# Altium project EVK-NORA-W1.PrjPcb (part 3 of 3)
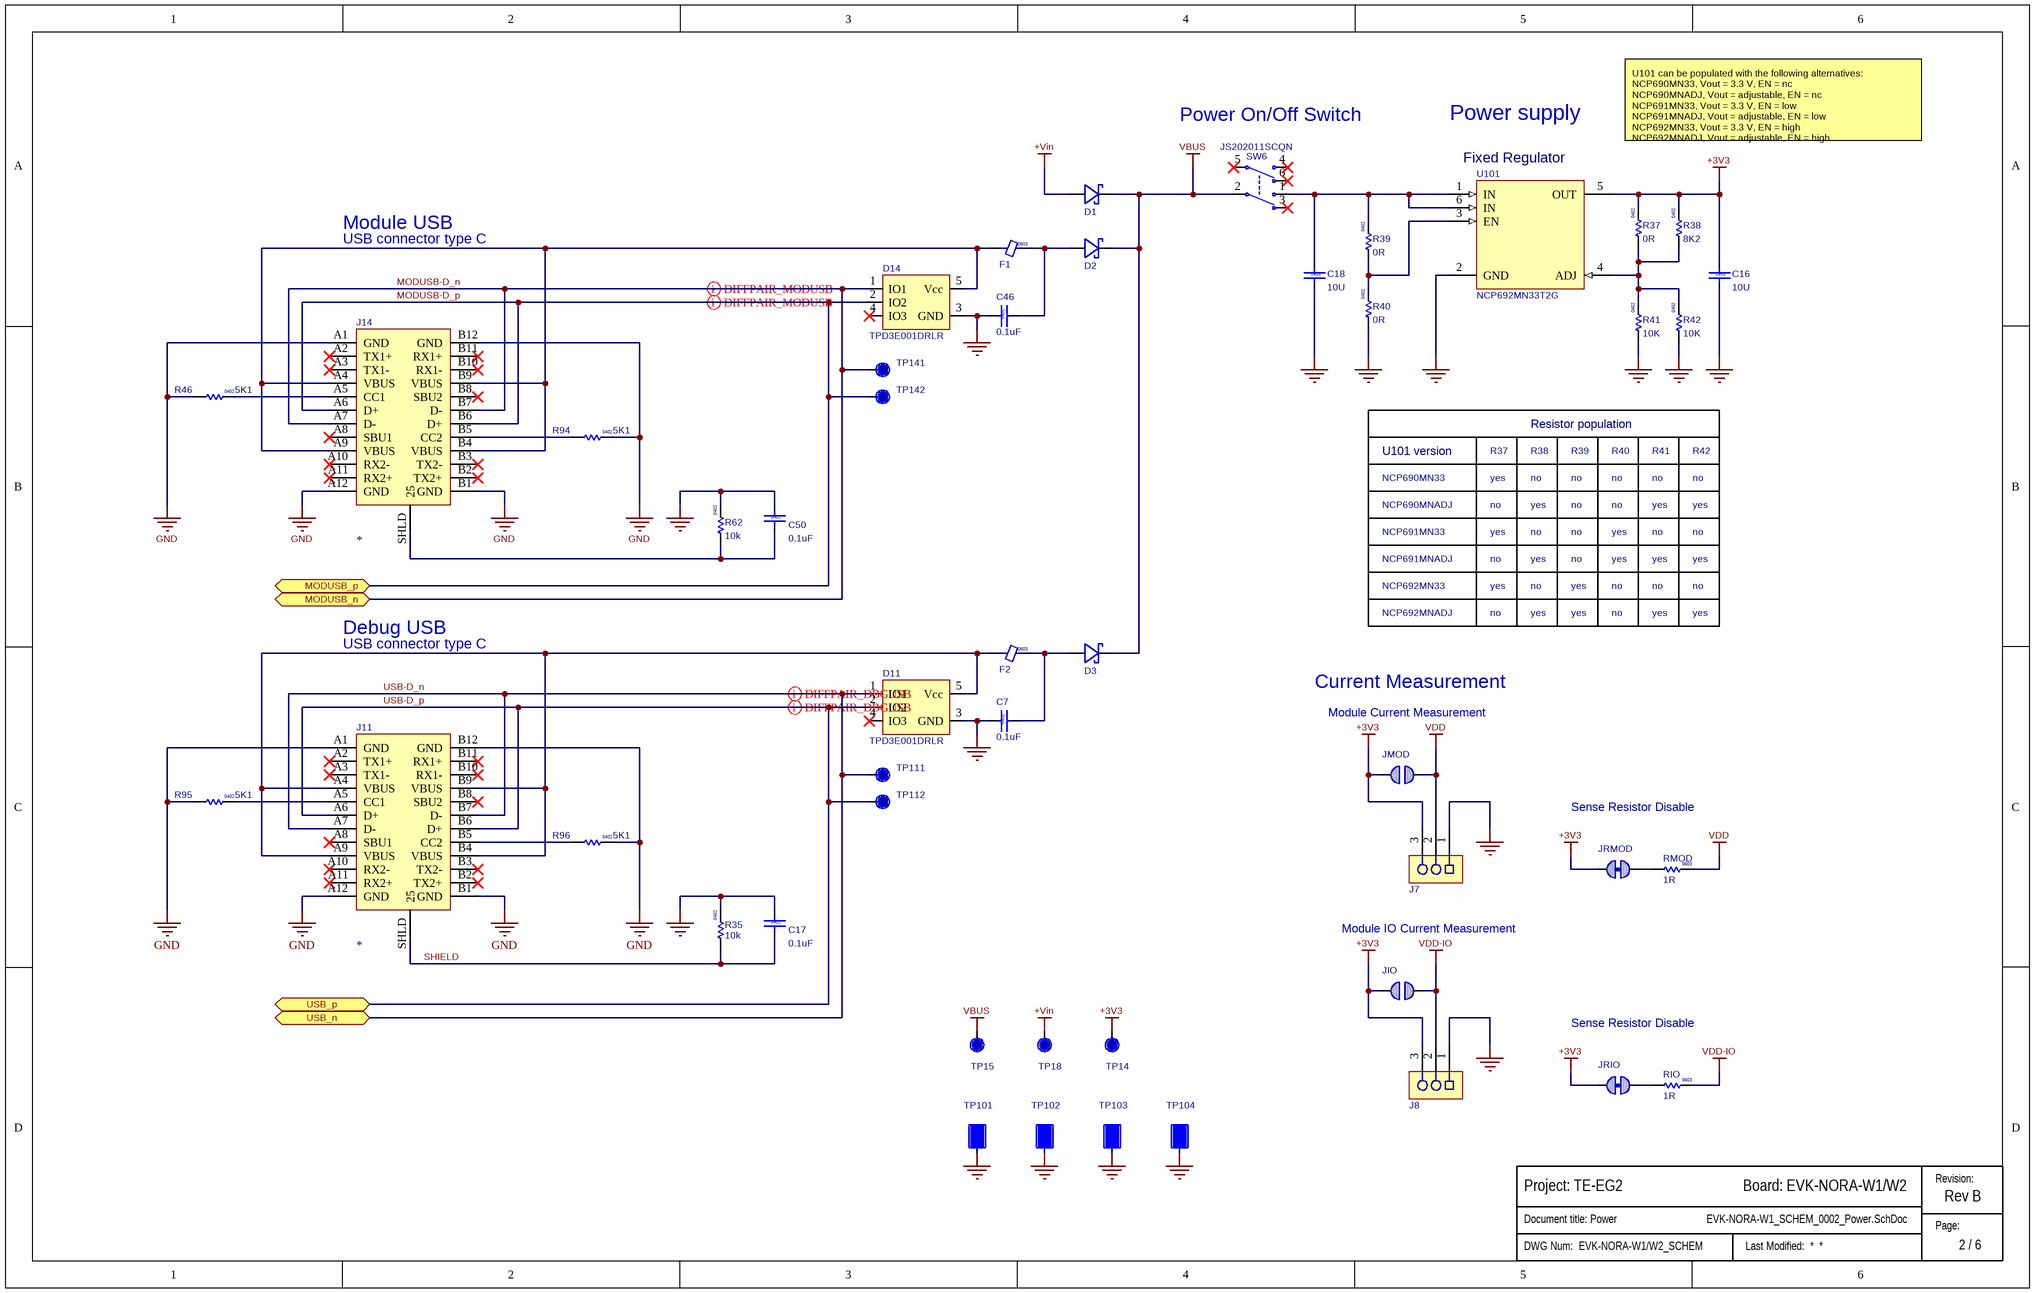
[diagram p6: EVK-NORA-W1_SCHEM_0002_Power.SchDoc]

## Nets that join several sheets
+3V3: EVK-NORA-W1_SCHEM_0001_NORA_W1_Module (7 pins), EVK-NORA-W1_SCHEM_0004_Interface_FTDI (21 pins), EVK-NORA-W1_SCHEM_0003_Shield_Conn (6 pins), EVK-NORA-W1_SCHEM_0005_Interface_Isolation (21 pins), EVK-NORA-W1_SCHEM_0002_Power (11 pins)
+Vin: EVK-NORA-W1_SCHEM_0003_Shield_Conn (J1.8), EVK-NORA-W1_SCHEM_0002_Power (D1.A TP18.1)
GND: EVK-NORA-W1_SCHEM_0001_NORA_W1_Module (42 pins), EVK-NORA-W1_SCHEM_0004_Interface_FTDI (39 pins), EVK-NORA-W1_SCHEM_0003_Shield_Conn (12 pins), EVK-NORA-W1_SCHEM_0005_Interface_Isolation (24 pins), EVK-NORA-W1_SCHEM_0002_Power (32 pins)
IOREF: EVK-NORA-W1_SCHEM_0003_Shield_Conn (J1.2 TP12.1 U6.5), EVK-NORA-W1_SCHEM_0005_Interface_Isolation (6 pins)
VBUS: EVK-NORA-W1_SCHEM_0003_Shield_Conn (J1.5), EVK-NORA-W1_SCHEM_0002_Power (5 pins)
VDD: EVK-NORA-W1_SCHEM_0001_NORA_W1_Module (C2.1 C4.1 U5.A8), EVK-NORA-W1_SCHEM_0002_Power (J7.2 JMOD.1 RMOD.2)
VDD-IO: EVK-NORA-W1_SCHEM_0001_NORA_W1_Module (C5.1 C6.1 U5.A7 U5.B7), EVK-NORA-W1_SCHEM_0002_Power (J8.2 JIO.1 RIO.2)
FTDI-BOOTn: EVK-NORA-W1_SCHEM_0001_NORA_W1_Module (R10.1), EVK-NORA-W1_SCHEM_0004_Interface_FTDI (U108.23)
FTDI-CTS: EVK-NORA-W1_SCHEM_0001_NORA_W1_Module (R29.1), EVK-NORA-W1_SCHEM_0004_Interface_FTDI (U108.41 U109.6)
FTDI-DSR: EVK-NORA-W1_SCHEM_0001_NORA_W1_Module (R32.1), EVK-NORA-W1_SCHEM_0004_Interface_FTDI (U108.44 U109.4)
FTDI-DTR: EVK-NORA-W1_SCHEM_0001_NORA_W1_Module (R30.1), EVK-NORA-W1_SCHEM_0004_Interface_FTDI (U108.43 U109.18)
FTDI-RESETn: EVK-NORA-W1_SCHEM_0001_NORA_W1_Module (R9.1), EVK-NORA-W1_SCHEM_0004_Interface_FTDI (U108.22)
FTDI-RTS: EVK-NORA-W1_SCHEM_0001_NORA_W1_Module (R23.1), EVK-NORA-W1_SCHEM_0004_Interface_FTDI (U108.40 U109.19)
FTDI-RxD: EVK-NORA-W1_SCHEM_0001_NORA_W1_Module (R22.1), EVK-NORA-W1_SCHEM_0004_Interface_FTDI (U108.39 U109.1)
FTDI-SPI-CLK: EVK-NORA-W1_SCHEM_0001_NORA_W1_Module (R12.1), EVK-NORA-W1_SCHEM_0004_Interface_FTDI (U108.26)
FTDI-SPI-CS: EVK-NORA-W1_SCHEM_0001_NORA_W1_Module (R15.1), EVK-NORA-W1_SCHEM_0004_Interface_FTDI (U108.29)
FTDI-SPI-D: EVK-NORA-W1_SCHEM_0001_NORA_W1_Module (R13.1), EVK-NORA-W1_SCHEM_0004_Interface_FTDI (U108.27)
FTDI-SPI-HD: EVK-NORA-W1_SCHEM_0001_NORA_W1_Module (R17.1), EVK-NORA-W1_SCHEM_0004_Interface_FTDI (U108.32)
FTDI-SPI-Q: EVK-NORA-W1_SCHEM_0001_NORA_W1_Module (R14.1), EVK-NORA-W1_SCHEM_0004_Interface_FTDI (U108.28)
FTDI-SPI-WP: EVK-NORA-W1_SCHEM_0001_NORA_W1_Module (R16.1), EVK-NORA-W1_SCHEM_0004_Interface_FTDI (U108.30)
FTDI-TCK: EVK-NORA-W1_SCHEM_0001_NORA_W1_Module (R5.1), EVK-NORA-W1_SCHEM_0004_Interface_FTDI (U108.16)
FTDI-TDI: EVK-NORA-W1_SCHEM_0001_NORA_W1_Module (R6.1), EVK-NORA-W1_SCHEM_0004_Interface_FTDI (U108.17)
FTDI-TDO: EVK-NORA-W1_SCHEM_0001_NORA_W1_Module (R7.1), EVK-NORA-W1_SCHEM_0004_Interface_FTDI (U108.18)
FTDI-TMS: EVK-NORA-W1_SCHEM_0001_NORA_W1_Module (R8.1), EVK-NORA-W1_SCHEM_0004_Interface_FTDI (U108.19)
FTDI-TxD: EVK-NORA-W1_SCHEM_0001_NORA_W1_Module (R20.1), EVK-NORA-W1_SCHEM_0004_Interface_FTDI (U108.38 U109.17)
GPIO0/BOOTn: EVK-NORA-W1_SCHEM_0001_NORA_W1_Module (R10.2 U5.F7), EVK-NORA-W1_SCHEM_0003_Shield_Conn (6 pins)
GPIO1/UART0-DTR: EVK-NORA-W1_SCHEM_0001_NORA_W1_Module (R32.2 U5.E8), EVK-NORA-W1_SCHEM_0003_Shield_Conn (JRMOD2.2), EVK-NORA-W1_SCHEM_0005_Interface_Isolation (R58.2 U3.1 U103.8)
GPIO2/ADC1-CH1: EVK-NORA-W1_SCHEM_0001_NORA_W1_Module (U5.H8), EVK-NORA-W1_SCHEM_0003_Shield_Conn (J3.3 R78.1 TP33.1)
GPIO3/ADC1-CH2: EVK-NORA-W1_SCHEM_0001_NORA_W1_Module (U5.J9), EVK-NORA-W1_SCHEM_0003_Shield_Conn (J3.4 TP34.1)
GPIO4/ADC1-CH3: EVK-NORA-W1_SCHEM_0001_NORA_W1_Module (U5.D8), EVK-NORA-W1_SCHEM_0003_Shield_Conn (J3.5 TP35.1)
GPIO5/ADC1-CH4: EVK-NORA-W1_SCHEM_0001_NORA_W1_Module (U5.J8), EVK-NORA-W1_SCHEM_0003_Shield_Conn (J2.4 R77.1 TP24.1)
GPIO6/UART0-CTS: EVK-NORA-W1_SCHEM_0001_NORA_W1_Module (R23.2 U5.F9), EVK-NORA-W1_SCHEM_0005_Interface_Isolation (R57.2 U4.3 U103.7)
GPIO7/UART0-DSR: EVK-NORA-W1_SCHEM_0001_NORA_W1_Module (R30.2 U5.E9), EVK-NORA-W1_SCHEM_0005_Interface_Isolation (R59.2 U3.3 U103.9)
GPIO8/ADC1-CH7: EVK-NORA-W1_SCHEM_0001_NORA_W1_Module (U5.H9), EVK-NORA-W1_SCHEM_0003_Shield_Conn (R79.1 TP108.1 TP612.1)
GPIO9/ADC1-CH8: EVK-NORA-W1_SCHEM_0001_NORA_W1_Module (U5.E7), EVK-NORA-W1_SCHEM_0003_Shield_Conn (TP109.1 TP614.1)
GPIO10/FSPI-IO4: EVK-NORA-W1_SCHEM_0001_NORA_W1_Module (U5.H3), EVK-NORA-W1_SCHEM_0005_Interface_Isolation (R51.2 U102.9)
GPIO11/ADC2-CH0: EVK-NORA-W1_SCHEM_0001_NORA_W1_Module (U5.G3), EVK-NORA-W1_SCHEM_0003_Shield_Conn (J2.1 TP21.1)
GPIO12/ADC2-CH1: EVK-NORA-W1_SCHEM_0001_NORA_W1_Module (U5.G2), EVK-NORA-W1_SCHEM_0003_Shield_Conn (J2.2 TP22.1)
GPIO13/ADC2-CH2: EVK-NORA-W1_SCHEM_0001_NORA_W1_Module (U5.A6), EVK-NORA-W1_SCHEM_0003_Shield_Conn (J2.3 TP23.1)
GPIO14/FSPI-DQS: EVK-NORA-W1_SCHEM_0001_NORA_W1_Module (U5.A5), EVK-NORA-W1_SCHEM_0005_Interface_Isolation (R52.2 U103.1)
GPIO15/ADC2-CH4: EVK-NORA-W1_SCHEM_0001_NORA_W1_Module (J19.3), EVK-NORA-W1_SCHEM_0003_Shield_Conn (J2.5 TP25.1)
GPIO16/ADC2-CH5: EVK-NORA-W1_SCHEM_0001_NORA_W1_Module (J21.3), EVK-NORA-W1_SCHEM_0003_Shield_Conn (J2.6 TP26.1)
GPIO17/I2C-SCL: EVK-NORA-W1_SCHEM_0001_NORA_W1_Module (U5.A3), EVK-NORA-W1_SCHEM_0005_Interface_Isolation (R64.2 U104.5)
GPIO18/I2C-SDA: EVK-NORA-W1_SCHEM_0001_NORA_W1_Module (U5.B4), EVK-NORA-W1_SCHEM_0005_Interface_Isolation (R63.2 U104.4)
GPIO21: EVK-NORA-W1_SCHEM_0001_NORA_W1_Module (U5.C8), EVK-NORA-W1_SCHEM_0005_Interface_Isolation (R43.2 U102.1)
GPIO33/FSPI-HD: EVK-NORA-W1_SCHEM_0001_NORA_W1_Module (R17.2 U5.D3), EVK-NORA-W1_SCHEM_0005_Interface_Isolation (R50.2 U102.8)
GPIO34/FSPI-CS0: EVK-NORA-W1_SCHEM_0001_NORA_W1_Module (R15.2 U5.B3), EVK-NORA-W1_SCHEM_0005_Interface_Isolation (R48.2 U102.6)
GPIO35/FSPI-D: EVK-NORA-W1_SCHEM_0001_NORA_W1_Module (R13.2 U5.C2), EVK-NORA-W1_SCHEM_0005_Interface_Isolation (R47.2 U102.5)
GPIO36/FSPI-CLK: EVK-NORA-W1_SCHEM_0001_NORA_W1_Module (R12.2 U5.B1), EVK-NORA-W1_SCHEM_0005_Interface_Isolation (R44.2 U102.3)
GPIO37/FSPI-Q: EVK-NORA-W1_SCHEM_0001_NORA_W1_Module (R14.2 U5.C1), EVK-NORA-W1_SCHEM_0005_Interface_Isolation (R45.2 U102.4)
GPIO38/FSPI-WP: EVK-NORA-W1_SCHEM_0001_NORA_W1_Module (R16.2 U5.A2), EVK-NORA-W1_SCHEM_0005_Interface_Isolation (R49.2 U102.7)
GPIO39: EVK-NORA-W1_SCHEM_0001_NORA_W1_Module (J16.3 R2.1), EVK-NORA-W1_SCHEM_0005_Interface_Isolation (R65.2 U104.6)
GPIO40: EVK-NORA-W1_SCHEM_0001_NORA_W1_Module (J17.3 R3.1), EVK-NORA-W1_SCHEM_0005_Interface_Isolation (R66.2 U104.7)
GPIO41: EVK-NORA-W1_SCHEM_0001_NORA_W1_Module (J18.3 R4.1), EVK-NORA-W1_SCHEM_0005_Interface_Isolation (R67.2 U104.8)
GPIO42: EVK-NORA-W1_SCHEM_0001_NORA_W1_Module (J15.3 R1.1), EVK-NORA-W1_SCHEM_0005_Interface_Isolation (R68.2 U104.9)
GPIO43/UART0-TxD: EVK-NORA-W1_SCHEM_0001_NORA_W1_Module (R22.2 U5.G8), EVK-NORA-W1_SCHEM_0005_Interface_Isolation (R54.2 U7.1 U103.4)
GPIO44/UART0-RxD: EVK-NORA-W1_SCHEM_0001_NORA_W1_Module (R20.2 U5.G9), EVK-NORA-W1_SCHEM_0005_Interface_Isolation (R55.2 U7.3 U103.5)
GPIO45/UART0-RTS: EVK-NORA-W1_SCHEM_0001_NORA_W1_Module (R29.2 U5.F8), EVK-NORA-W1_SCHEM_0003_Shield_Conn (JRMOD4.2), EVK-NORA-W1_SCHEM_0005_Interface_Isolation (R56.2 U4.1 U103.6)
GPIO46: EVK-NORA-W1_SCHEM_0001_NORA_W1_Module (U5.H7), EVK-NORA-W1_SCHEM_0005_Interface_Isolation (5 pins)
GPIO47/SPI-CLKp: EVK-NORA-W1_SCHEM_0001_NORA_W1_Module (U5.F3), EVK-NORA-W1_SCHEM_0005_Interface_Isolation (5 pins)
GPIO48/SPI-CLKn: EVK-NORA-W1_SCHEM_0001_NORA_W1_Module (U5.E3), EVK-NORA-W1_SCHEM_0005_Interface_Isolation (5 pins)
MODUSB-D_n: EVK-NORA-W1_SCHEM_0001_NORA_W1_Module (C43.1 R27.1), EVK-NORA-W1_SCHEM_0002_Power (D14.1 J14.A7 J14.B7 TP141.1)
MODUSB-D_p: EVK-NORA-W1_SCHEM_0001_NORA_W1_Module (C44.1 R26.1), EVK-NORA-W1_SCHEM_0002_Power (D14.2 J14.A6 J14.B6 TP142.1)
REFIO1/UART0-DTR: EVK-NORA-W1_SCHEM_0003_Shield_Conn (J5.3), EVK-NORA-W1_SCHEM_0005_Interface_Isolation (R58.1 TP53.1 U103.13)
REFIO6/UART0-CTS: EVK-NORA-W1_SCHEM_0003_Shield_Conn (J5.2), EVK-NORA-W1_SCHEM_0005_Interface_Isolation (R57.1 TP52.1 U103.14)
REFIO7/UART0-DSR: EVK-NORA-W1_SCHEM_0003_Shield_Conn (J5.4), EVK-NORA-W1_SCHEM_0005_Interface_Isolation (R59.1 TP54.1 U103.12)
REFIO10/FSPI-IO4: EVK-NORA-W1_SCHEM_0003_Shield_Conn (J3.1), EVK-NORA-W1_SCHEM_0005_Interface_Isolation (R51.1 TP31.1 U102.12)
REFIO14/FSPI-DQS: EVK-NORA-W1_SCHEM_0003_Shield_Conn (J3.2), EVK-NORA-W1_SCHEM_0005_Interface_Isolation (R52.1 TP32.1 U103.20)
REFIO17/I2C-SCL: EVK-NORA-W1_SCHEM_0003_Shield_Conn (J5.8), EVK-NORA-W1_SCHEM_0005_Interface_Isolation (R64.1 TP58.1 U104.16)
REFIO18/I2C-SDA: EVK-NORA-W1_SCHEM_0003_Shield_Conn (J5.7), EVK-NORA-W1_SCHEM_0005_Interface_Isolation (R63.1 TP57.1 U104.17)
REFIO21: EVK-NORA-W1_SCHEM_0003_Shield_Conn (J4.2), EVK-NORA-W1_SCHEM_0005_Interface_Isolation (R43.1 TP42.1 U102.20)
REFIO33/FSPI-HD: EVK-NORA-W1_SCHEM_0003_Shield_Conn (J4.10), EVK-NORA-W1_SCHEM_0005_Interface_Isolation (R50.1 TP40.1 U102.13)
REFIO34/FSPI-CS0: EVK-NORA-W1_SCHEM_0003_Shield_Conn (J4.8), EVK-NORA-W1_SCHEM_0005_Interface_Isolation (R48.1 TP48.1 U102.15)
REFIO35/FSPI-D: EVK-NORA-W1_SCHEM_0003_Shield_Conn (J4.7), EVK-NORA-W1_SCHEM_0005_Interface_Isolation (R47.1 TP47.1 U102.16)
REFIO36/FSPI-CLK: EVK-NORA-W1_SCHEM_0003_Shield_Conn (J4.5), EVK-NORA-W1_SCHEM_0005_Interface_Isolation (R44.1 TP45.1 U102.18)
REFIO37/FSPI-Q: EVK-NORA-W1_SCHEM_0003_Shield_Conn (J4.6), EVK-NORA-W1_SCHEM_0005_Interface_Isolation (R45.1 TP46.1 U102.17)
REFIO38/FSPI-WP: EVK-NORA-W1_SCHEM_0003_Shield_Conn (J4.9), EVK-NORA-W1_SCHEM_0005_Interface_Isolation (R49.1 TP49.1 U102.14)
REFIO39: EVK-NORA-W1_SCHEM_0003_Shield_Conn (TP603.1), EVK-NORA-W1_SCHEM_0005_Interface_Isolation (R65.1 TP139.1 U104.15)
REFIO40: EVK-NORA-W1_SCHEM_0003_Shield_Conn (TP605.1), EVK-NORA-W1_SCHEM_0005_Interface_Isolation (R66.1 TP140.1 U104.14)
REFIO41: EVK-NORA-W1_SCHEM_0003_Shield_Conn (TP607.1), EVK-NORA-W1_SCHEM_0005_Interface_Isolation (R67.1 TP143.1 U104.13)
REFIO42: EVK-NORA-W1_SCHEM_0003_Shield_Conn (TP609.1), EVK-NORA-W1_SCHEM_0005_Interface_Isolation (R68.1 TP144.1 U104.12)
REFIO43/UART0-TxD: EVK-NORA-W1_SCHEM_0003_Shield_Conn (J3.7), EVK-NORA-W1_SCHEM_0005_Interface_Isolation (R54.1 TP37.1 U103.17)
REFIO44/UART0-RxD: EVK-NORA-W1_SCHEM_0003_Shield_Conn (J3.8), EVK-NORA-W1_SCHEM_0005_Interface_Isolation (R55.1 TP38.1 U103.16)
REFIO45/UART0-RTS: EVK-NORA-W1_SCHEM_0003_Shield_Conn (J5.1), EVK-NORA-W1_SCHEM_0005_Interface_Isolation (R56.1 TP51.1 U103.15)
REFIO46: EVK-NORA-W1_SCHEM_0003_Shield_Conn (J3.6), EVK-NORA-W1_SCHEM_0005_Interface_Isolation (R53.1 TP36.1 U103.18)
REFIO47/SPI-CLKp: EVK-NORA-W1_SCHEM_0003_Shield_Conn (J5.5), EVK-NORA-W1_SCHEM_0005_Interface_Isolation (R60.1 TP55.1 U104.20)
REFIO48/SPI-CLKn: EVK-NORA-W1_SCHEM_0003_Shield_Conn (J5.6), EVK-NORA-W1_SCHEM_0005_Interface_Isolation (R61.1 TP56.1 U104.18)
RESETn: EVK-NORA-W1_SCHEM_0001_NORA_W1_Module (J20.10 R9.2 U5.J3), EVK-NORA-W1_SCHEM_0003_Shield_Conn (7 pins)
USB-D_n: EVK-NORA-W1_SCHEM_0004_Interface_FTDI (R28.2), EVK-NORA-W1_SCHEM_0002_Power (D11.1 J11.A7 J11.B7 TP111.1)
USB-D_p: EVK-NORA-W1_SCHEM_0004_Interface_FTDI (R24.2), EVK-NORA-W1_SCHEM_0002_Power (D11.2 J11.A6 J11.B6 TP112.1)

## Assembly variants
EVK-NORA-W1_4CH-FTDI_692-3V3: not fitted C1 C3 C12 C19 C22 C23 C24 C26 C27 C29 C34 C38 C42 C43 C44 C45 C47 F5 L1 R1 R2 R3 R4 R5 R6 R7 R8 R9 R10 R11 R12 R13 R14 R15 R16 R17 R19 R21 R38 R40 R41 R42 R69 R70 R71 R83 R91 R92 U1 U2 U102 U103 U104 U109
EVK-NORA-W1_1CH-FTDI_692-3V3: not fitted C10 C12 C13 C14 C19 C20 C21 C22 C23 C24 C26 C27 C28 C29 C30 C31 C32 C33 C35 C36 C37 C41 C42 C43 C44 C45 C47 C60 C61 F3 F4 J9 L1 R1 R2 R3 R4 R5 R6 R7 R8 R9 R10 R11 R12 R13 R14 R15 R16 R17 R19 R21 R38 R40 R41 R42 R69 R70 R71 R83 R84 R85 R86 R87 R88 R89 R90 U1 U2 U102 U103 U104 U107 U108 X2